# EAGLE design zLineIn_fp_00 (EAGLE 6.5.0)
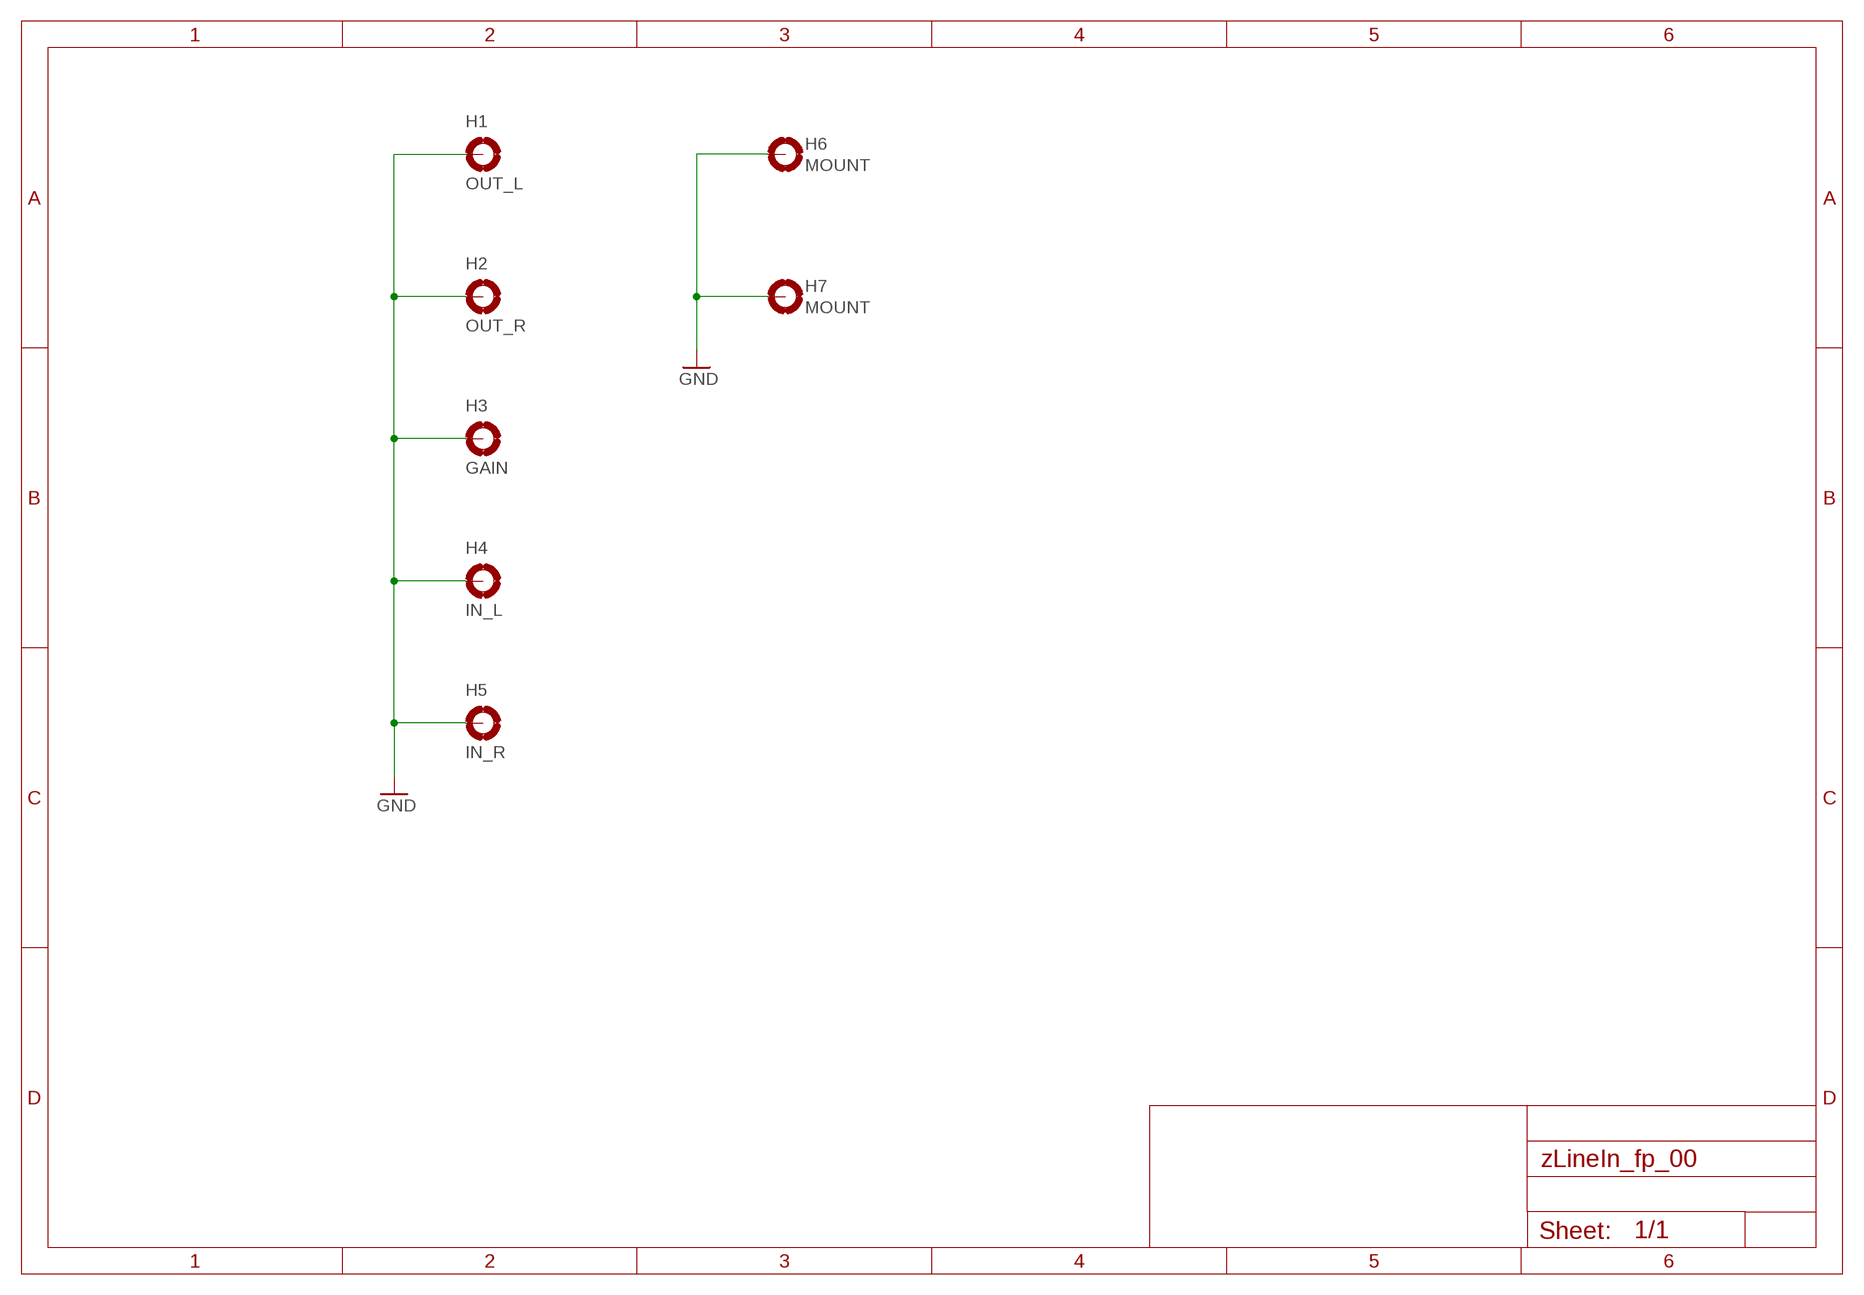
[diagram p0: schematic, sheet 1]

## Parts
H1  OUT_L  MOUNT-PAD-ROUND6.223  [6,223-PAD]
H2  OUT_R  MOUNT-PAD-ROUND6.223  [6,223-PAD]
H3  GAIN  MOUNT-PAD-ROUND7.112  [7.112-PAD]
H4  IN_L  MOUNT-PAD-ROUND11,43  [11.43-PAD]
H5  IN_R  MOUNT-PAD-ROUND11,43  [11.43-PAD]
H6  MOUNT  MOUNT-PAD-LONG3.2  [3,2-PAD_L]
H7  MOUNT  MOUNT-PAD-LONG3.2  [3,2-PAD_L]

## Nets
GND: H1.B6,223(MOUNT) H2.B6,223(MOUNT) H3.B4,5(MOUNT) H4.B5,5(MOUNT) H5.B5,5(MOUNT) H6.B3,2(MOUNT) H7.B3,2(MOUNT)

## Library data of the parts
H1-H5 = _motovilo_holes:MOUNT-PAD-ROUND: MOUNTING PAD, round
H6 H7 = _motovilo_holes:MOUNT-PAD-LONG: MOUNTING PAD, long

## Board
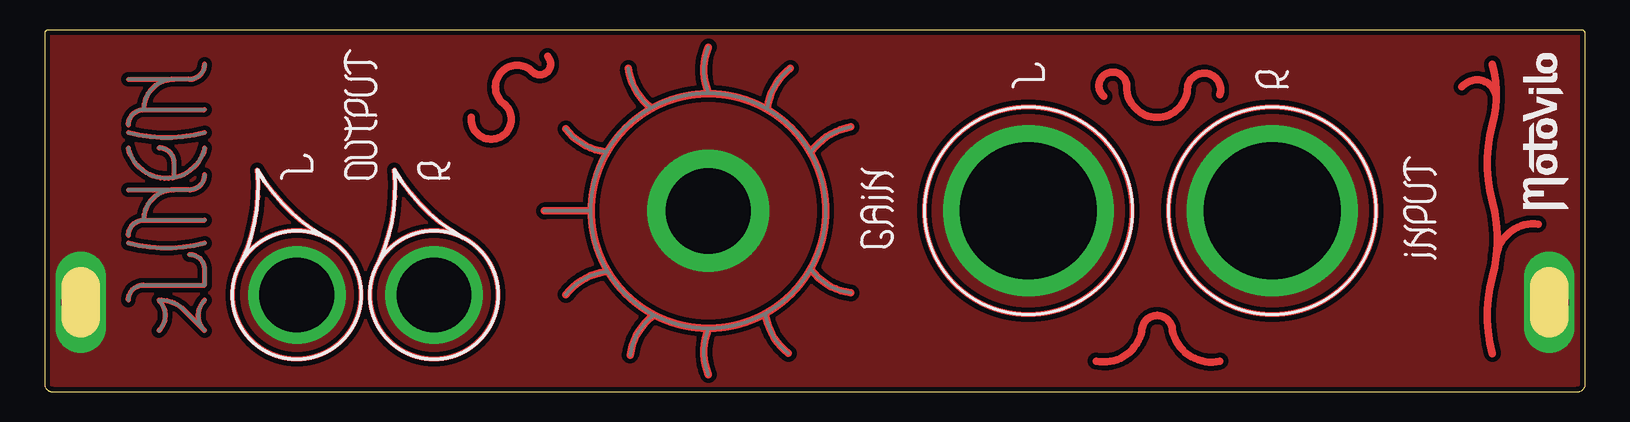
[diagram p1: board, top side]
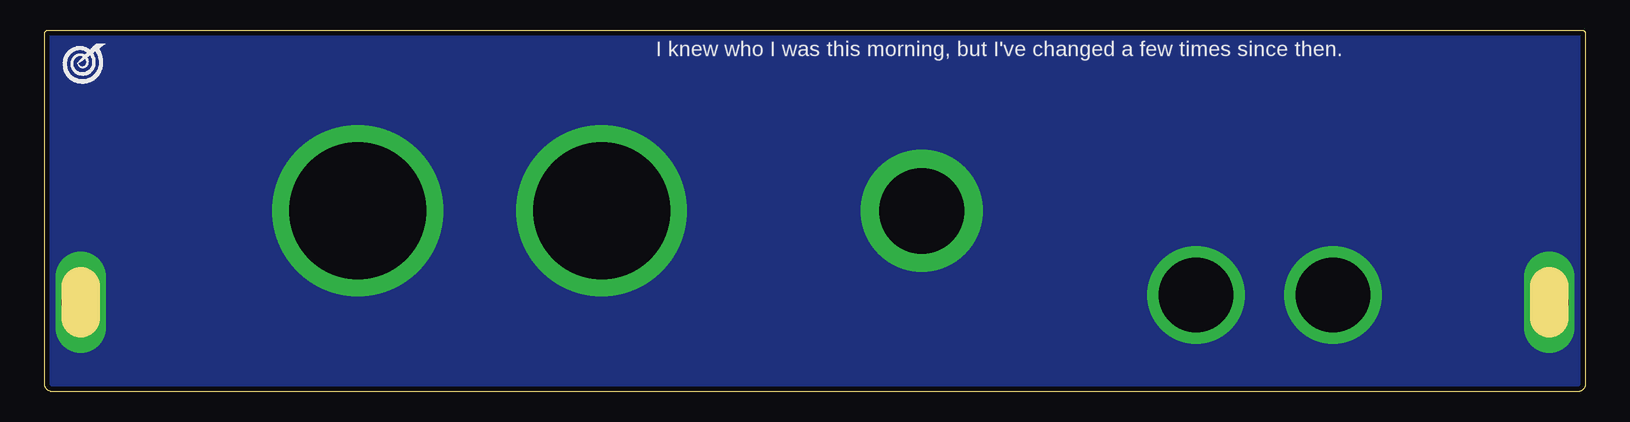
[diagram p2: board, bottom side, seen from below]

Size 128.4 x 30.14 mm. Coordinates in mm from the lower left corner, seen from the top.
Outline: 128.08,30.14 0.29,30.14 arc90 0,29.84 0,0.64 arc90 0.64,0 127.75,0 arc90 128.4,0.65 128.4,29.82 arc90 128.08,30.14
Copper layers (1*16): Top 0.035mm / dielectric 1.5mm / Bottom 0.035mm
Design rules "ITEADstudio_DRC_z": minimum track width 10mil, minimum drill 12mil, track to track 10mil, track to pad 10mil, pad to pad 10mil, via to via 10mil, smd to smd 10mil, copper to edge 10mil, drill to drill 25mil, minimum pad ring 10mil, minimum via ring 6mil, stop-mask expansion 2mil, vias tented up to drill 100mil, thermal gap 12mil

### Footprints (pad centres in the part's own frame; a part is rotated, then mirrored left to right if it is on the bottom)
6,223-PAD = drill 6.223 pad 8.128: B6,223 0,0
7.112-PAD = drill 7.112 pad 10.16: B4,5 0,0
11.43-PAD = drill 11.43 pad 14.224: B5,5 0,0
3,2-PAD_L = drill 3.2 pad 3.81 long: B3,2 0,0

### Placement (x,y rotation side)
E$2  [OUTPUT_0.1]  27.62,17.78 90 top
E$3  [L]  22.29,17.78 90 top
E$4  [R]  33.72,17.78 90 top
E$5  [GAIN]  70.8,12.06 90 top
E$6  [SCALE-0.8M]  55.31,15.07 90 top
E$7  [L]  83.25,25.4 90 top
E$8  [R]  103.57,25.4 90 top
E$9  [INPUT]  115.89,11.11 90 top
H1  21.02,8.07 0 top
H2  32.45,8.07 0 top
H3  55.31,15.07 0 top
H4  102.3,15.07 0 top
H5  81.98,15.07 0 top
H6  3,7.45 90 top
H7  125.4,7.45 90 top
U$1  [CATSEYE3]  21.02,8.07 0 top
U$2  [LOGO_SPACE_002A]  127,15.24 90 top
U$3  [CATSEYE3]  32.45,8.07 0 top
U$4  [ZLINEIN_6.35]  13.34,5.08 90 top
U$5  [LOGO_1]  127,25.4 0 bottom

### Tracks (layer width: path | path; a pad name or v marks a point on that pad's centre or on a via)
GND
  pour Top (isolate 0.406, no thermals): 0,0 0,30.14 128.4,30.14 128.4,0
  pour Bottom (isolate 0.406, no thermals): 0,0 0,30.14 128.4,30.14 128.4,0
N$3
  Top 0.61: 120.65,27.3 arc-30 120.65,22.23 arc30 120.65,15.88 arc-30 120.65,9.53 arc30 120.65,3.17
N$4
  Top 0.61: 120.97,24.13 arc148 118.11,25.4
N$5
  Top 0.61: 120.97,11.27 arc-90 124.46,13.97
N$6
  Top 0.61: 87.63,2.54 arc90 91.44,5.08 arc-180 93.98,5.08 arc90 97.95,2.54
N$7
  Top 0.61: 88.27,24.61 arc-233 90.17,25.4 arc180 95.25,25.4 arc-186 97.95,24.77
N$8
  Top 0.61: 35.56,22.86 arc243 38.1,24.13 arc-180 40.64,26.67 arc180 41.91,27.94

### Text on the board
bPlace: I knew who I was this morning, but I've changed a few times since then.